# EAGLE design pro-one-mix-and-modified-noise (EAGLE 5.07)
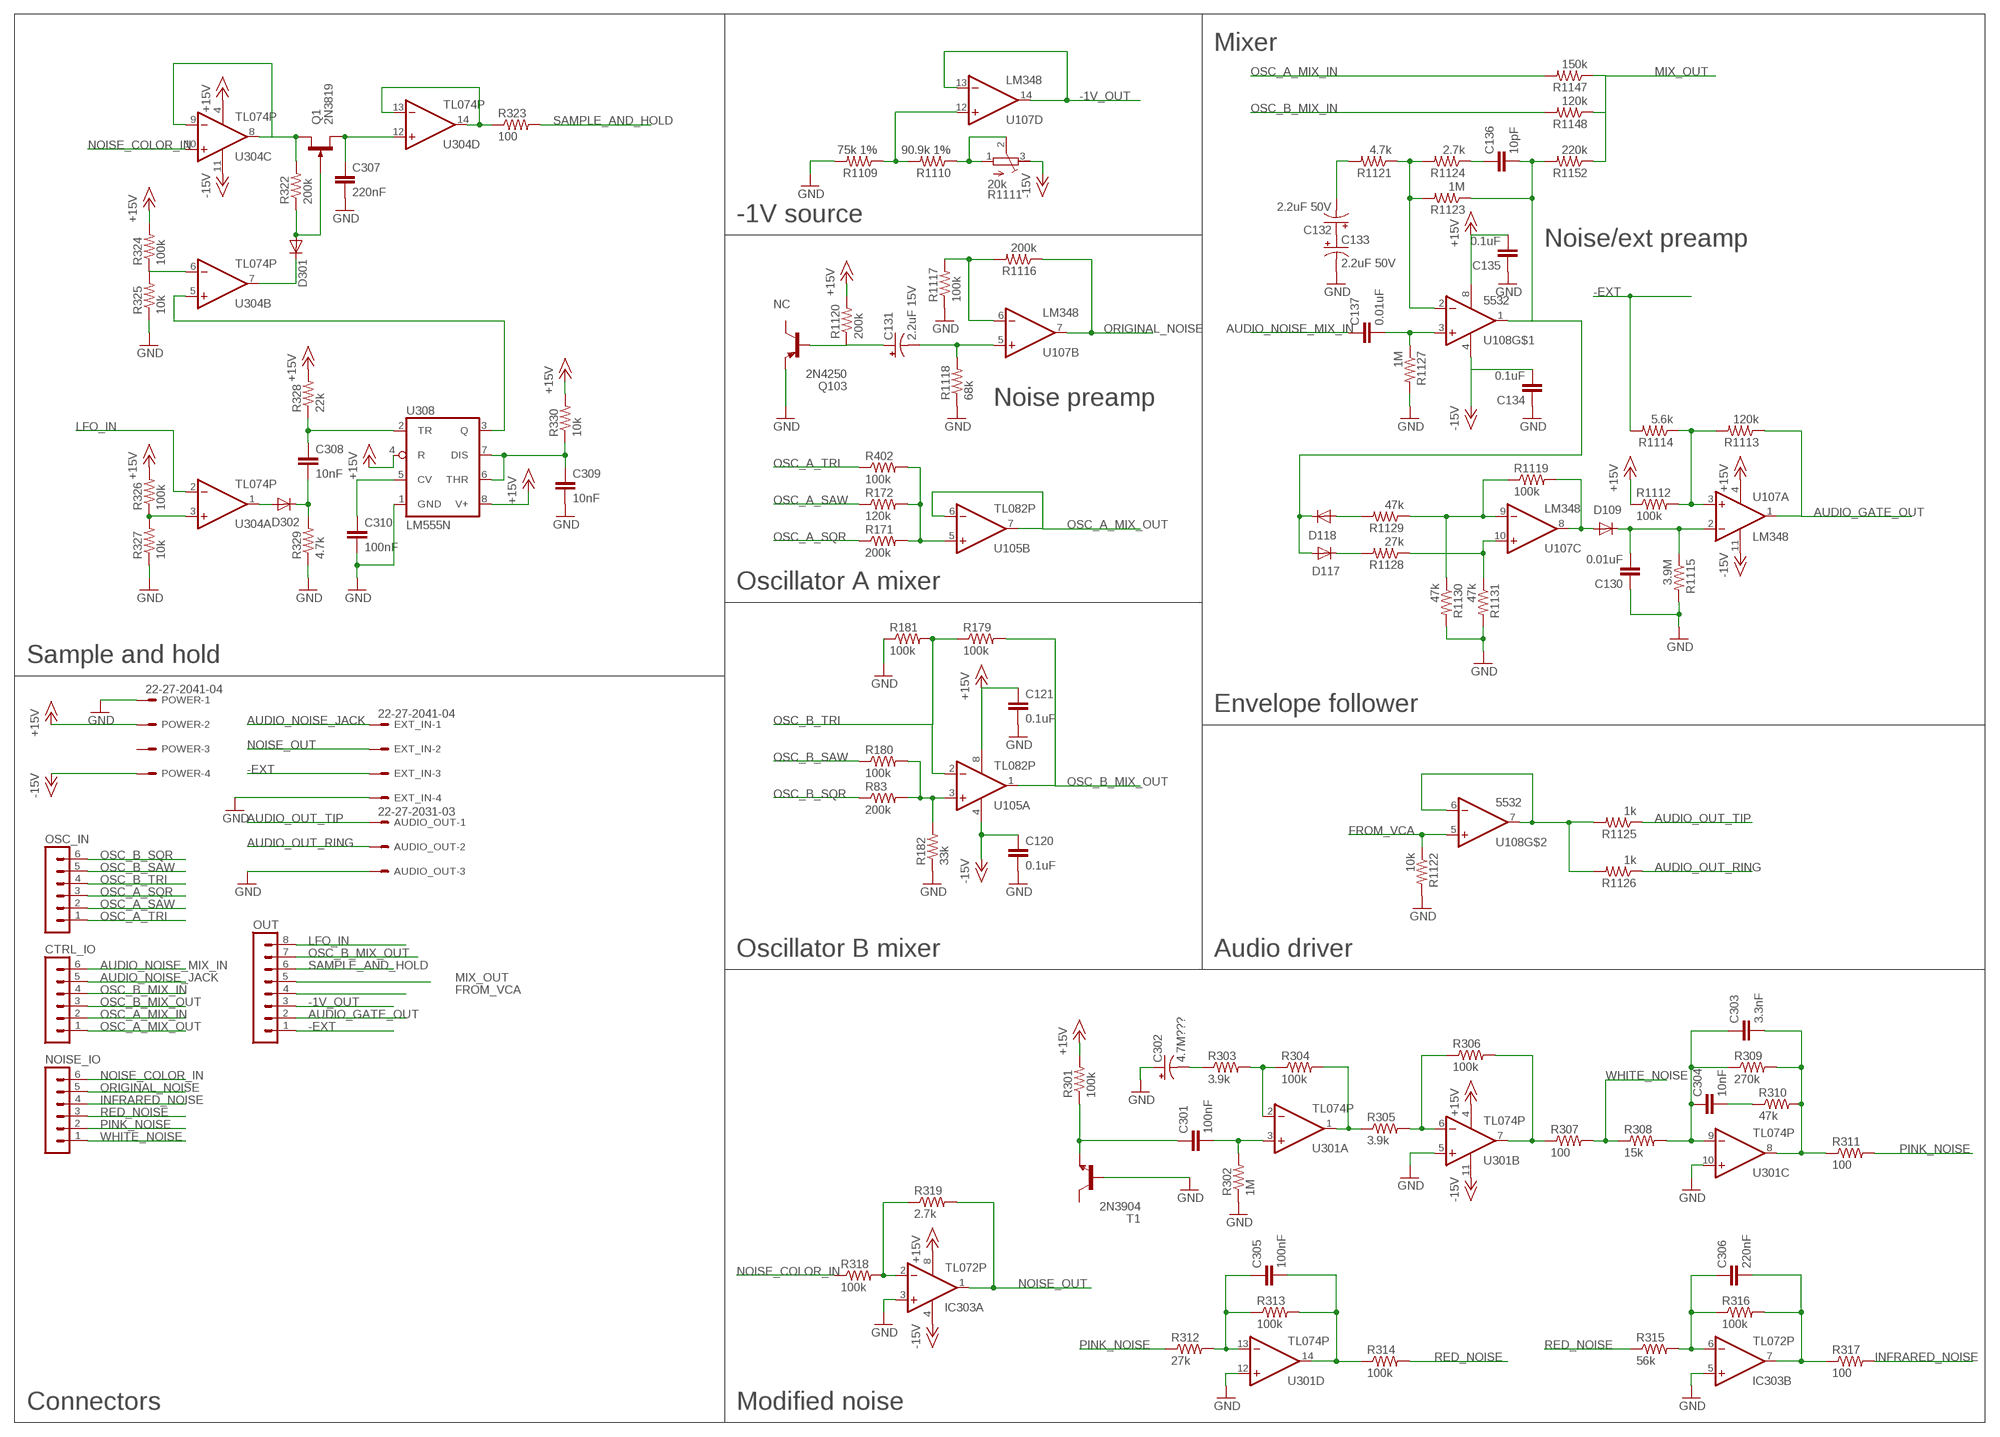
[diagram p0: schematic, sheet 1]

## Parts
AUDIO_OUT  22-27-2031-03  [6410-03]
C120  0.1uF  C-EU050-025X075  [C050-025X075]
C121  0.1uF  C-EU050-025X075  [C050-025X075]
C130  0.01uF  C-EU050-025X075  [C050-025X075]
C131  2.2uF 15V  CPOL-USE2.5-5  [E2,5-5]
C132  2.2uF 50V  CPOL-USE2.5-5  [E2,5-5]
C133  2.2uF 50V  CPOL-USE2.5-5  [E2,5-5]
C134  0.1uF  C-EU050-025X075  [C050-025X075]
C135  0.1uF  C-EU050-025X075  [C050-025X075]
C136  10pF  C-EU050-025X075  [C050-025X075]
C137  0.01uF  C-EU050-025X075  [C050-025X075]
C301  100nF  C-EU050-025X075  [C050-025X075]
C302  4.7M???  CPOL-USE2.5-5  [E2,5-5]
C303  3.3nF  C-EU050-025X075  [C050-025X075]
C304  10nF  C-EU050-025X075  [C050-025X075]
C305  100nF  C-EU050-025X075  [C050-025X075]
C306  220nF  C-EU050-025X075  [C050-025X075]
C307  220nF  C-EU050-025X075  [C050-025X075]
C308  10nF  C-EU050-025X075  [C050-025X075]
C309  10nF  C-EU050-025X075  [C050-025X075]
C310  100nF  C-EU050-025X075  [C050-025X075]
CTRL_IO  MA06-1  [MA06-1]
D109  1N4148DO35-7  [DO35-7]
D117  1N4148DO35-7  [DO35-7]
D118  1N4148DO35-7  [DO35-7]
D301  1N4148DO35-7  [DO35-7]
D302  1N4148DO35-7  [DO35-7]
EXT_IN  22-27-2041-04  [6410-04]
IC303  TL072P  [DIL08]
NOISE_IO  MA06-1  [MA06-1]
OSC_IN  MA06-1  [MA06-1]
OUT  MA08-1  [MA08-1]
POWER  22-27-2041-04  [6410-04]
Q1  2N3819  [TO92F]
Q103  2N4250  [TO92]
R83  200k  R-US_0309/10  [0309/10]
R171  200k  R-US_0309/10  [0309/10]
R172  120k  R-US_0309/10  [0309/10]
R179  100k  R-US_0309/10  [0309/10]
R180  100k  R-US_0309/10  [0309/10]
R181  100k  R-US_0309/10  [0309/10]
R182  33k  R-US_0309/10  [0309/10]
R301  100k  R-US_0309/10  [0309/10]
R302  1M  R-US_0309/10  [0309/10]
R303  3.9k  R-US_0309/10  [0309/10]
R304  100k  R-US_0309/10  [0309/10]
R305  3.9k  R-US_0309/10  [0309/10]
R306  100k  R-US_0309/10  [0309/10]
R307  100  R-US_0309/10  [0309/10]
R308  15k  R-US_0309/10  [0309/10]
R309  270k  R-US_0309/10  [0309/10]
R310  47k  R-US_0309/10  [0309/10]
R311  100  R-US_0309/10  [0309/10]
R312  27k  R-US_0309/10  [0309/10]
R313  100k  R-US_0309/10  [0309/10]
R314  100k  R-US_0309/10  [0309/10]
R315  56k  R-US_0309/10  [0309/10]
R316  100k  R-US_0309/10  [0309/10]
R317  100  R-US_0309/10  [0309/10]
R318  100k  R-US_0309/10  [0309/10]
R319  2.7k  R-US_0309/10  [0309/10]
R322  200k  R-US_0309/10  [0309/10]
R323  100  R-US_0309/10  [0309/10]
R324  100k  R-US_0309/10  [0309/10]
R325  10k  R-US_0309/10  [0309/10]
R326  100k  R-US_0309/10  [0309/10]
R327  10k  R-US_0309/10  [0309/10]
R328  22k  R-US_0309/10  [0309/10]
R329  4.7k  R-US_0309/10  [0309/10]
R330  10k  R-US_0309/10  [0309/10]
R402  100k  R-US_0309/10  [0309/10]
R1109  75k 1%  R-US_0309/10  [0309/10]
R1110  90.9k 1%  R-US_0309/10  [0309/10]
R1111  20k  R-TRIMM64W  [RTRIM64W]
R1112  100k  R-US_0309/10  [0309/10]
R1113  120k  R-US_0309/10  [0309/10]
R1114  5.6k  R-US_0309/10  [0309/10]
R1115  3.9M  R-US_0309/10  [0309/10]
R1116  200k  R-US_0309/10  [0309/10]
R1117  100k  R-US_0309/10  [0309/10]
R1118  68k  R-US_0309/10  [0309/10]
R1119  100k  R-US_0309/10  [0309/10]
R1120  200k  R-US_0309/10  [0309/10]
R1121  4.7k  R-US_0309/10  [0309/10]
R1122  10k  R-US_0309/10  [0309/10]
R1123  1M  R-US_0309/10  [0309/10]
R1124  2.7k  R-US_0309/10  [0309/10]
R1125  1k  R-US_0309/10  [0309/10]
R1126  1k  R-US_0309/10  [0309/10]
R1127  1M  R-US_0309/10  [0309/10]
R1128  27k  R-US_0309/10  [0309/10]
R1129  47k  R-US_0309/10  [0309/10]
R1130  47k  R-US_0309/10  [0309/10]
R1131  47k  R-US_0309/10  [0309/10]
R1147  150k  R-US_0309/10  [0309/10]
R1148  120k  R-US_0309/10  [0309/10]
R1152  220k  R-US_0309/10  [0309/10]
T1  2N3904  [TO92]
U105  TL082P  [DIL08]
U107  LM348  [DIL14]
U108  5532  [DIL08]
U301  TL074P  [DIL14]
U304  TL074P  [DIL14]
U308  LM555N  [DIL08]

## Nets
+15V: C121.1 C135.2 IC303.8(P:V+) POWER.2 R301.2 R324.2 R326.2 R328.2 R330.2 R1112.1 R1120.2 U105.8(P:V+) U107.4(P:V+) U108.8(V+) U301.4(P:V+) U304.4(P:V+) U308.4(R) U308.8(V+)
-1V_OUT: OUT.3 U107.13(D:-IN) U107.14(D:OUT)
-15V: C120.1 C134.2 IC303.4(P:V-) POWER.4 R1111.3(A) U105.4(P:V-) U107.11(P:V-) U108.4(V-) U301.11(P:V-) U304.11(P:V-)
-EXT: EXT_IN.3 OUT.1 R1114.2
AUDIO_GATE_OUT: OUT.2 R1113.1 U107.1(A:OUT)
AUDIO_NOISE_JACK: CTRL_IO.5 EXT_IN.1
AUDIO_NOISE_MIX_IN: C137.1 CTRL_IO.6
AUDIO_OUT_RING: AUDIO_OUT.2 R1126.1
AUDIO_OUT_TIP: AUDIO_OUT.1 R1125.1
FROM_VCA: OUT.4 R1122.1 U108.5(+IN)
GND: C120.2 C121.2 C130.1 C133.- C134.1 C135.1 C302.+ C307.2 C309.2 C310.2 EXT_IN.4 IC303.3(A:+IN) IC303.5(B:+IN) POWER.1 Q103.3(E) R181.1 R182.1 R302.1 R325.1 R327.1 R329.1 R1109.2 R1115.2 R1117.1 R1118.1 R1122.2 R1127.2 R1130.2 R1131.2 T1.2(B) U301.5(B:+IN) U301.10(C:+IN) U301.12(D:+IN) U308.1(GND)
INFRARED_NOISE: NOISE_IO.4 R317.2
LFO_IN: OUT.8 U304.2(A:-IN)
MIX_OUT: OUT.5 R1147.1 R1148.1 R1152.1
N$1: R171.2 R172.2 R402.2 U105.5(B:+IN)
N$2: R83.2 R180.2 R182.2 U105.3(A:+IN)
N$3: C131.- R1118.2 U107.5(B:+IN)
N$4: C131.+ Q103.2(B) R1120.1
N$5: R1116.2 R1117.2 U107.6(B:-IN)
N$6: C132.+ C133.+
N$7: R1109.1 R1110.2 U107.12(D:+IN)
N$8: R1110.1 R1111.1(E) R1111.2(S)
N$9: C132.- R1121.2
N$10: D118.A R1129.2
N$11: C136.1 R1124.1
N$12: C136.2 D117.A D118.C R1123.1 R1152.2 U108.1(OUT)
N$13: C137.2 R1127.1 U108.3(+IN)
N$14: R1121.1 R1123.2 R1124.2 U108.2(-IN)
N$15: D117.C R1128.2
N$16: R1119.1 R1129.1 R1130.1 U107.9(C:-IN)
N$17: R1128.1 R1131.1 U107.10(C:+IN)
N$18: R1112.2 R1113.2 R1114.1 U107.3(A:+IN)
N$19: R1125.2 R1126.2 U108.6(-IN) U108.7(OUT)
N$20: C301.1 R301.1 T1.3(E)
N$21: D109.A R1119.2 U107.8(C:OUT)
N$22: C130.2 D109.C R1115.1 U107.2(A:-IN)
N$23: C301.2 R302.2 U301.3(A:+IN)
N$24: C302.- R303.1
N$25: R303.2 R304.1 U301.2(A:-IN)
N$26: R304.2 R305.1 U301.1(A:OUT)
N$27: R305.2 R306.1 U301.6(B:-IN)
N$28: C305.1 R312.2 R313.1 U301.13(D:-IN)
N$29: R306.2 R307.1 U301.7(B:OUT)
N$30: C305.2 R313.2 R314.1 U301.14(D:OUT)
N$31: C303.1 C304.1 R308.2 R309.1 U301.9(C:-IN)
N$32: C306.1 IC303.6(B:-IN) R315.2 R316.1
N$33: C304.2 R310.1
N$34: C303.2 R309.2 R310.2 R311.1 U301.8(C:OUT)
N$35: C306.2 IC303.7(B:OUT) R316.2 R317.1
N$36: R324.1 R325.2 U304.6(B:-IN)
N$37: IC303.2(A:-IN) R318.2 R319.1
N$38: R326.1 R327.2 U304.3(A:+IN)
N$39: D302.A U304.1(A:OUT)
N$40: C308.2 D302.C R329.2
N$41: C308.1 R328.1 U308.2(TR)
N$42: U304.5(B:+IN) U308.3(Q)
N$43: C310.1 U308.5(CV)
N$44: C309.1 R330.1 U308.6(THR) U308.7(DIS)
N$45: D301.C U304.7(B:OUT)
N$46: D301.A Q1.G R322.1
N$47: Q1.D R322.2 U304.8(C:OUT) U304.9(C:-IN)
N$48: C307.1 Q1.S U304.12(D:+IN)
N$49: R323.1 U304.13(D:-IN) U304.14(D:OUT)
N$50: AUDIO_OUT.3 ; supply symbol labelled GND
NOISE_COLOR_IN: NOISE_IO.6 R318.1 U304.10(C:+IN)
NOISE_OUT: EXT_IN.2 IC303.1(A:OUT) R319.2
ORIGINAL_NOISE: NOISE_IO.5 R1116.1 U107.7(B:OUT)
OSC_A_MIX_IN: CTRL_IO.2 R1147.2
OSC_A_MIX_OUT: CTRL_IO.1 U105.6(B:-IN) U105.7(B:OUT)
OSC_A_SAW: OSC_IN.2 R172.1
OSC_A_SQR: OSC_IN.3 R171.1
OSC_A_TRI: OSC_IN.1 R402.1
OSC_B_MIX_IN: CTRL_IO.4 R1148.2
OSC_B_MIX_OUT: CTRL_IO.3 OUT.7 R179.2 U105.1(A:OUT)
OSC_B_SAW: OSC_IN.5 R180.1
OSC_B_SQR: OSC_IN.6 R83.1
OSC_B_TRI: OSC_IN.4 R179.1 R181.2 U105.2(A:-IN)
PINK_NOISE: NOISE_IO.2 R311.2 R312.1
RED_NOISE: NOISE_IO.3 R314.2 R315.1
SAMPLE_AND_HOLD: OUT.6 R323.2
WHITE_NOISE: NOISE_IO.1 R307.2 R308.1
Unconnected: POWER.3 Q103.1(C) T1.1(C)

## Notes on the sheet
- Mixer
- -1V source
- Noise/ext preamp
- NC
- Noise preamp
- Oscillator A mixer
- Sample and hold
- Envelope follower
- Oscillator B mixer | Audio driver
- Connectors | Modified noise

## Library data of the parts
AUDIO_OUT = con-molex:22-?-03: CONNECTOR wire to board 2.54 mm (.1 inch) pitch header
C120 C121 C130 C134-C137 C301 C303-C310 = resistor:C-EU: CAPACITOR, European symbol
C131-C133 C302 = rcl:CPOL-US: POLARIZED CAPACITOR, American symbol
CTRL_IO NOISE_IO OSC_IN = con-lstb:MA06-1: PIN HEADER
D109 D117 D118 D301 D302 = diode:1N4148: DIODE high speed (Philips)
EXT_IN POWER = con-molex:22-?-04: CONNECTOR wire to board 2.54 mm (.1 inch) pitch header
IC303 = linear:TL072: OP AMP
OUT = con-lstb:MA08-1: PIN HEADER
Q1 = transistor-small-signal:2N3819: N-CHANNEL FET
Q103 = joakim:2N4250: PNP Transistor
R83 R171 R172 R179-R182 R301-R319 R322-R330 R402 R1109 R1110 R1112-R1131 R1147 R1148 R1152 = resistor:R-US_: RESISTOR, American symbol
R1111 = resistor:R-TRIMM: Trimm resistor
T1 = transistor:2N3904: NPN TRANSISTOR
U105 = linear:TL082: OP AMP
U107 = joakim:LM348: Quad General Purpose, Low Voltage, Operational Amplifiers
U108 = joakim:5532: DUAL LOW-NOISE OPERATIONAL AMPLIFIERS
U301 U304 = linear:TL074: OP AMP
U308 = linear:*555: TIMER

## Board
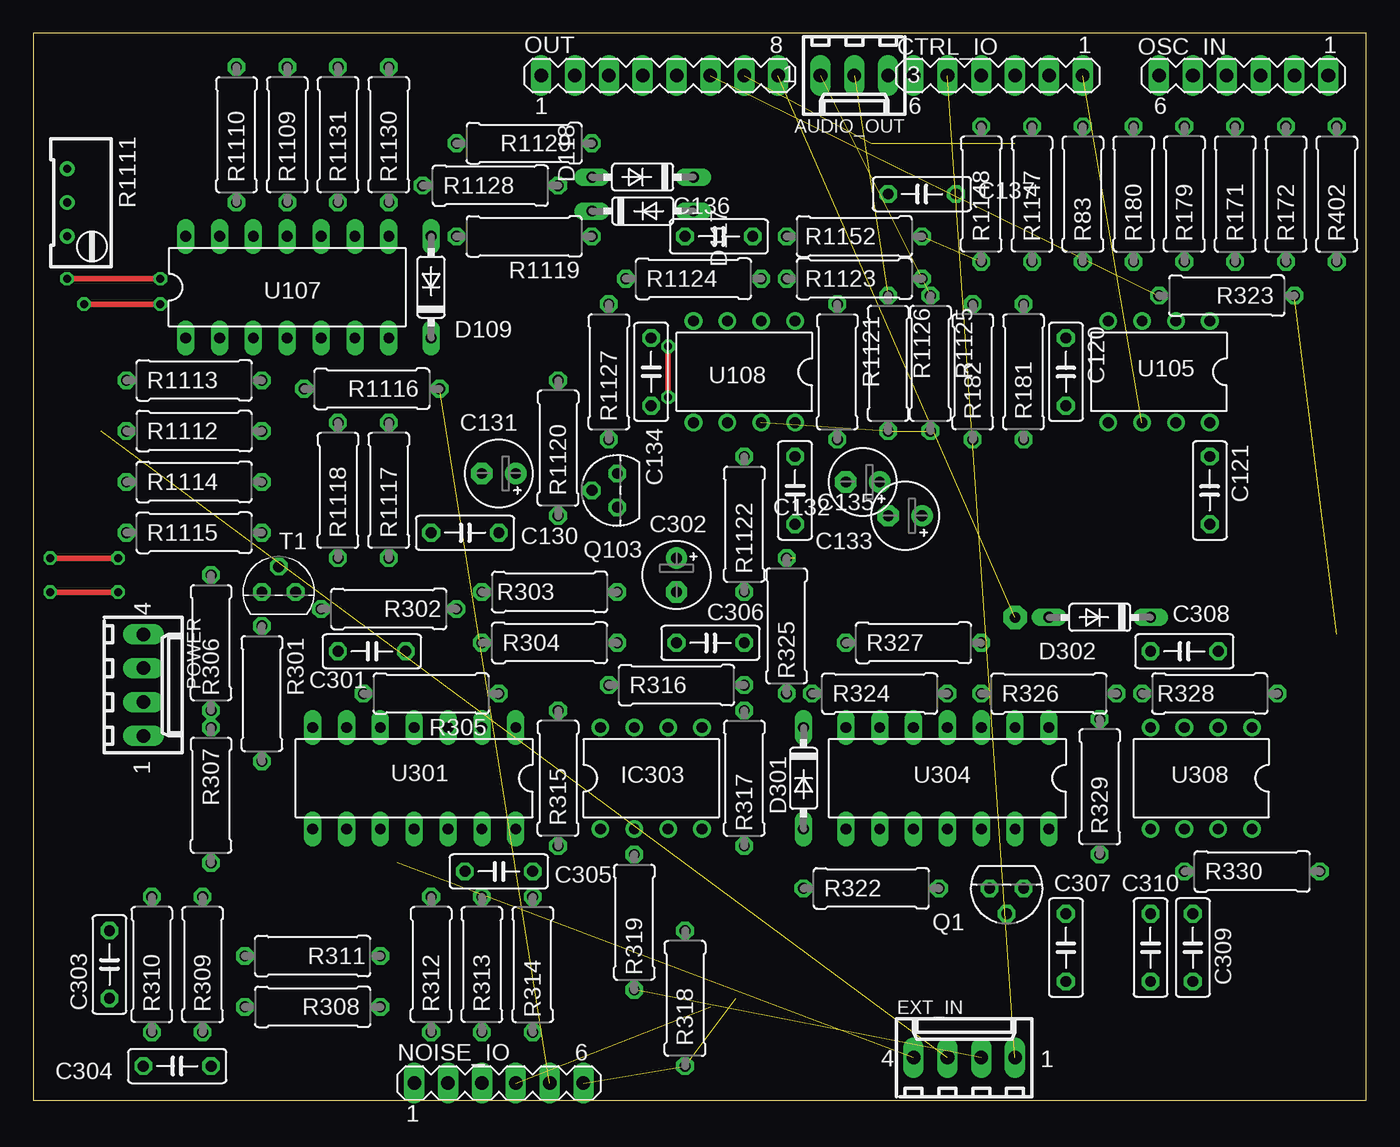
[diagram p1: board, top side]
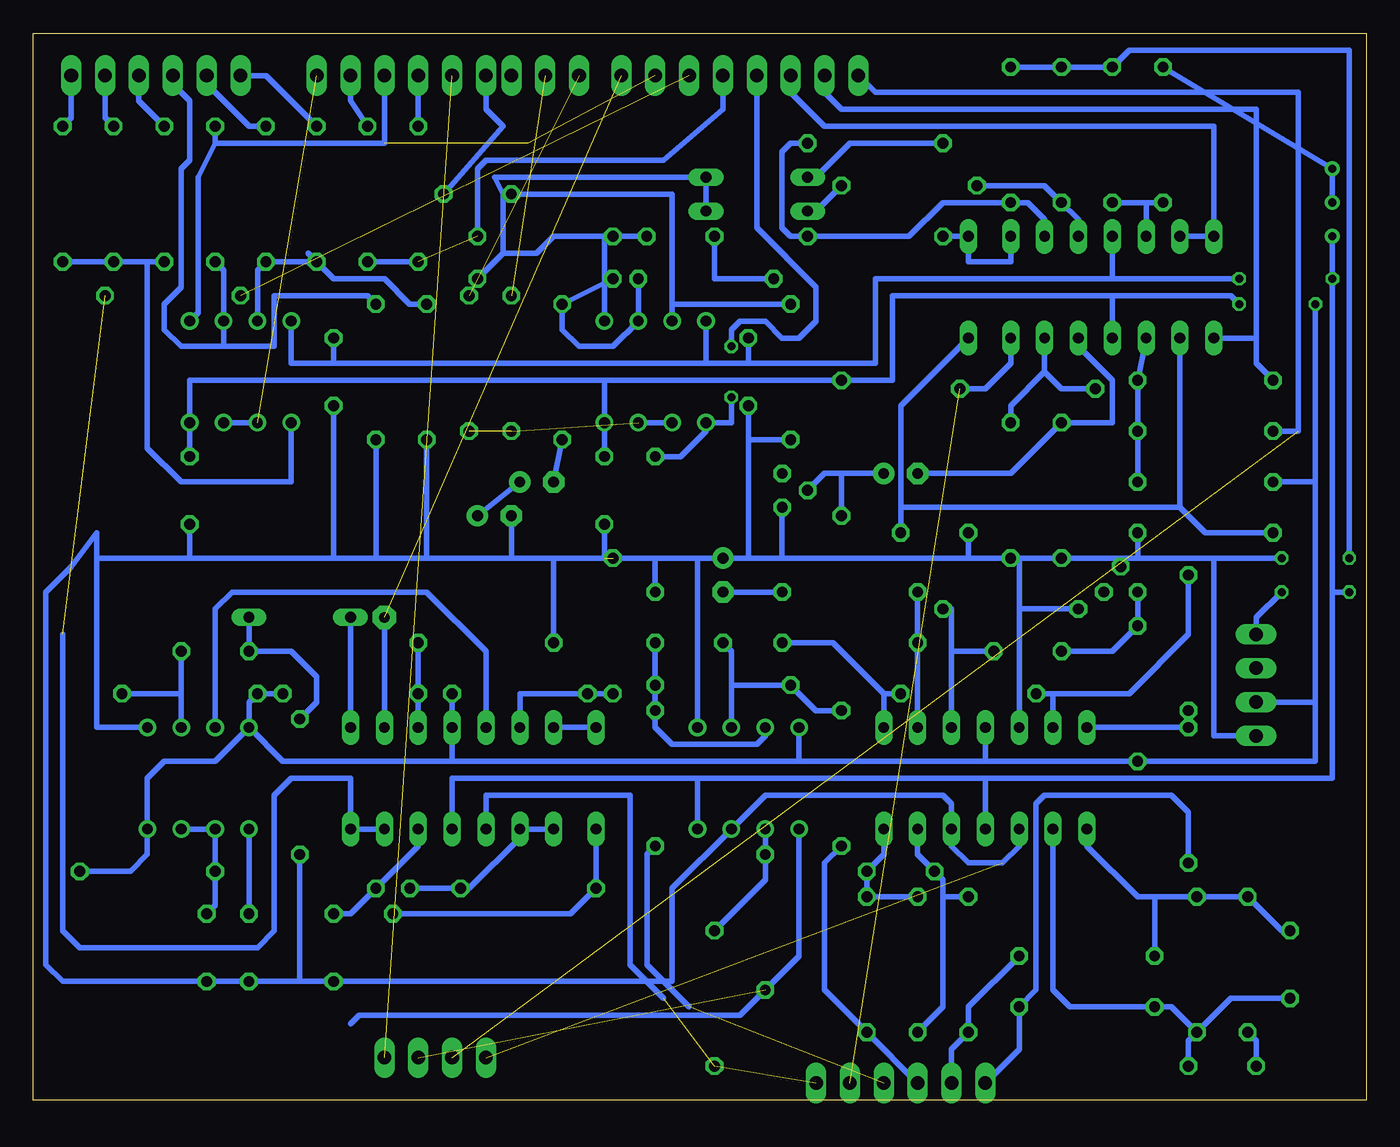
[diagram p2: board, bottom side, seen from below]

Size 100 x 80 mm. Coordinates in mm from the lower left corner, seen from the top.
Outline: 0,0 100,0 100,80 0,80 0,0
Copper layers (1*16): Top 0.035mm / dielectric 1.5mm / Bottom 0.035mm
Design rules "default": minimum track width 10mil, minimum drill 24mil, track to track 8mil, track to pad 8mil, pad to pad 8mil, via to via 8mil, smd to smd 8mil, copper to edge 40mil, drill to drill 8mil, minimum pad ring 10mil, minimum via ring 8mil, stop-mask expansion 4mil, vias tented up to drill 0mil, thermal gap 10mil

### Footprints (pad centres in the part's own frame; a part is rotated, then mirrored left to right if it is on the bottom)
6410-03 = drill 1.016 long: 1 2.54,0; 2 0,0; 3 -2.54,0
C050-025X075 = drill 0.813 octagon: 1 -2.54,0; 2 2.54,0
E2,5-5 = drill 0.813 pad 1.6 round: + -1.27,0 | drill 0.813 pad 1.6 octagon: - 1.27,0
MA06-1 = drill 1.016 long: 1 -6.35,0; 2 -3.81,0; 3 -1.27,0; 4 1.27,0; 5 3.81,0; 6 6.35,0
DO35-7 = drill 0.813 long: A 3.81,0; C -3.81,0
6410-04 = drill 1.016 long: 1 3.81,0; 2 1.27,0; 3 -1.27,0; 4 -3.81,0
DIL08 = drill 0.813 pad 1.27 round: 1 -3.81,-3.81; 2 -1.27,-3.81; 3 1.27,-3.81; 4 3.81,-3.81; 5 3.81,3.81; 6 1.27,3.81; 7 -1.27,3.81; 8 -3.81,3.81
MA08-1 = drill 1.016 long: 1 -8.89,0; 2 -6.35,0; 3 -3.81,0; 4 -1.27,0; 5 1.27,0; 6 3.81,0; 7 6.35,0; 8 8.89,0
TO92F = drill 0.813 octagon: D 1.27,0; G 0,1.905; S -1.27,0
TO92 = drill 0.813 octagon: 1 1.27,0; 2 0,1.905; 3 -1.27,0
0309/10 = drill 0.813 octagon: 1 -5.08,0; 2 5.08,0
RTRIM64W = drill 0.61 round: 1 1.27,-2.54; 2 1.27,0; 3 1.27,2.54
DIL14 = drill 0.813 long: 1 -7.62,-3.81; 2 -5.08,-3.81; 3 -2.54,-3.81; 4 0,-3.81; 5 2.54,-3.81; 6 5.08,-3.81; 7 7.62,-3.81; 8 7.62,3.81; 9 5.08,3.81; 10 2.54,3.81; 11 0,3.81; 12 -2.54,3.81; 13 -5.08,3.81; 14 -7.62,3.81

### Placement (x,y rotation side)
AUDIO_OUT  61.59,76.83 180 top
C120  77.47,54.61 270 top
C121  88.27,45.72 270 top
C130  32.38,42.55 0 top
C131  34.92,46.99 180 top
C132  62.23,46.35 180 top
C133  65.41,43.81 180 top
C134  46.35,54.61 90 top
C135  57.15,45.72 90 top
C136  51.44,64.77 0 top
C137  66.67,67.94 180 top
C301  25.4,33.66 0 top
C302  48.26,39.37 270 top
C303  5.71,10.16 90 top
C304  10.79,2.54 180 top
C305  34.92,17.14 0 top
C306  50.8,34.29 0 top
C307  77.47,11.43 270 top
C308  86.36,33.66 180 top
C309  87,11.43 270 top
C310  83.82,11.43 270 top
CTRL_IO  72.39,76.83 180 top
D109  29.84,60.96 90 top
D117  45.72,66.67 0 top
D118  45.72,69.22 180 top
D301  57.78,24.13 270 top
D302  80.01,36.2 180 top
EXT_IN  69.85,3.17 0 top
IC303  46.35,24.13 0 top
NOISE_IO  34.92,1.27 0 top
OSC_IN  90.81,76.83 180 top
OUT  46.99,76.83 0 top
POWER  8.26,31.11 270 top
Q1  73.03,15.88 180 top
Q103  43.81,45.72 90 top
R83  78.74,67.94 270 top
R171  90.17,67.94 270 top
R172  93.98,67.94 270 top
R179  86.36,67.94 90 top
R180  82.55,67.94 270 top
R181  74.3,54.61 90 top
R182  70.48,54.61 90 top
R301  17.14,30.48 270 top
R302  26.67,36.83 0 top
R303  38.73,38.1 180 top
R304  38.73,34.29 0 top
R305  29.84,30.48 180 top
R306  13.34,34.29 270 top
R307  13.34,22.86 270 top
R308  20.95,6.99 180 top
R309  12.7,10.16 90 top
R310  8.89,10.16 90 top
R311  20.95,10.79 0 top
R312  29.84,10.16 90 top
R313  33.66,10.16 90 top
R314  37.47,10.16 270 top
R315  39.37,24.13 90 top
R316  48.26,31.11 0 top
R317  53.34,24.13 270 top
R318  48.9,7.62 90 top
R319  45.09,13.34 270 top
R322  62.87,15.88 0 top
R323  89.53,60.33 180 top
R324  63.5,30.48 0 top
R325  56.52,35.56 270 top
R326  76.2,30.48 0 top
R327  66.04,34.29 0 top
R328  88.27,30.48 180 top
R329  80.01,23.5 90 top
R330  91.44,17.14 0 top
R402  97.79,67.94 270 top
R1109  19.05,72.39 90 top
R1110  15.24,72.39 270 top
R1111  3.81,67.31 180 top
R1112  12.06,46.35 0 top
R1113  12.06,53.98 0 top
R1114  12.06,50.16 180 top
R1115  12.06,42.55 0 top
R1116  25.4,53.34 180 top
R1117  26.67,45.72 90 top
R1118  22.86,45.72 90 top
R1119  36.83,64.77 180 top
R1120  39.37,48.9 90 top
R1121  60.33,54.61 270 top
R1122  53.34,43.18 270 top
R1123  61.59,61.59 180 top
R1124  49.53,61.59 0 top
R1125  67.31,55.24 270 top
R1126  64.14,55.24 270 top
R1127  43.18,54.61 270 top
R1128  34.29,68.58 0 top
R1129  36.83,71.75 180 top
R1130  26.67,72.39 90 top
R1131  22.86,72.39 90 top
R1147  74.93,67.94 90 top
R1148  71.12,67.94 90 top
R1152  61.59,64.77 180 top
T1  18.41,38.1 0 top
U105  84.45,54.61 180 top
U107  19.05,60.96 0 top
U108  53.34,54.61 180 top
U301  28.57,24.13 180 top
U304  68.58,24.13 180 top
U308  87.63,24.13 180 top

### Tracks (layer width: path | path; a pad name or v marks a point on that pad's centre or on a via)
+15V  (via drill 0.6)
  Top 0.406: v3.81,59.69 v9.53,59.69
  Bottom 0.406: 19.05,60.33 35.56,60.33 35.56,53.98 R1120.2 57.15,53.98 | 57.15,53.98 88.27,53.98 U105.8 C121.1 | 19.05,60.33 U107.4 | U308.4 81.28,25.4 68.58,25.4 | 28.57,25.4 42.55,25.4 | 42.55,25.4 68.58,25.4 | 28.57,25.4 U301.4 | 68.58,25.4 U304.4 R324.2 | 3.81,46.35 v3.81,59.69 | 3.81,29.84 3.81,25.4 R301.2 28.57,25.4 | R330.2 92.71,17.14 91.44,18.41 U308.8 91.44,24.13 90.17,25.4 86.36,25.4 U308.4 | U308.4 83.82,29.84 R328.2 R326.2 | 42.55,25.4 IC303.8 | 3.81,46.35 R1112.1 | 57.15,53.98 U108.8 C135.2 | v9.53,59.69 10.16,60.33 19.05,60.33 | 3.81,29.84 POWER.2 | 3.81,29.84 3.81,46.35
-1V_OUT
  Bottom 0.406: U107.13 U107.14 11.43,73.03 40.64,73.03 43.18,75.56 OUT.3
-15V  (via drill 0.6)
  Top 0.406: v2.54,61.59 v9.53,61.59 | v1.27,38.1 v6.35,38.1
  Bottom 0.406: 19.05,61.59 U107.11 | U304.11 68.58,24.13 50.16,24.13 | 28.57,24.13 50.16,24.13 | 28.57,24.13 U301.11 | 50.16,24.13 IC303.4 | R1111.3 v2.54,61.59 2.54,38.1 | 19.05,61.59 36.83,61.59 36.83,55.24 46.35,55.24 | U105.4 80.64,55.24 77.47,55.24 | 49.53,55.24 U108.4 | 77.47,55.24 C120.1 | 49.53,55.24 77.47,55.24 | 46.35,55.24 C134.2 | 46.35,55.24 49.53,55.24 | v9.53,61.59 19.05,61.59 | 2.54,38.1 2.54,24.13 28.57,24.13 | POWER.4 8.26,36.2 v6.35,38.1 | 2.54,38.1 v1.27,38.1
-EXT  (1 unrouted)
  Bottom 0.406: R1114.2 5.08,50.16 5.08,75.56 36.83,75.56 OUT.1
AUDIO_GATE_OUT
  Bottom 0.406: 8.26,57.15 U107.1 | 8.26,57.15 8.26,74.3 39.37,74.3 40.64,75.56 OUT.2 | R1113.1 8.26,55.24 8.26,57.15
AUDIO_NOISE_JACK  (1 unrouted)
AUDIO_NOISE_MIX_IN
  Bottom 0.406: C137.1 64.77,73.03 66.04,74.3 CTRL_IO.6
AUDIO_OUT_RING  (1 unrouted)
AUDIO_OUT_TIP  (1 unrouted)
FROM_VCA  (via drill 0.6)
  Top 0.406: v47.62,52.7 v47.62,56.52
  Bottom 0.406: R1122.1 51.44,48.26 49.53,50.16 U108.5 47.62,50.8 v47.62,52.7 | v47.62,56.52 47.62,57.78 46.99,58.42 45.09,58.42 43.81,57.15 42.55,57.15 41.27,58.42 41.27,60.96 45.72,65.41 OUT.4
GND  (via drill 0.6)  (2 unrouted)
  Top 0.406: v6.35,40.64 v1.27,40.64
  Bottom 0.406: 80.01,8.89 C310.2 C309.2 97.79,8.89 99.06,10.16 99.06,38.1 97.16,40.01 95.25,42.55 95.25,40.64 | 80.01,8.89 R329.1 | POWER.1 11.43,27.3 11.43,40.64 | U308.1 95.25,27.94 95.25,40.64 | 80.01,8.89 C307.2 52.07,8.89 52.07,15.88 IC303.3 45.09,22.86 31.75,22.86 31.11,22.23 U301.12 31.11,19.05 29.84,17.78 27.3,17.78 26.04,19.05 U301.10 | 11.43,40.64 17.14,40.64 | 17.14,40.64 18.41,40.64 | 18.41,40.64 R1118.1 | R1118.1 26.04,40.64 | 50.16,40.64 C302.+ 46.35,40.64 | 50.16,40.64 IC303.5 | 26.04,40.64 26.04,36.83 | 26.04,36.83 U301.5 | 18.41,40.64 T1.2 | 26.04,36.83 R302.1 | 26.04,40.64 R1117.1 | R1117.1 29.84,40.64 | 29.84,40.64 43.81,40.64 | 43.81,40.64 46.35,40.64 | 50.16,40.64 53.34,40.64 | 53.34,40.64 57.15,40.64 | 57.15,40.64 60.96,40.64 | 64.14,40.64 70.48,40.64 | 70.48,40.64 74.3,40.64 | 74.3,40.64 77.47,40.64 | 77.47,40.64 88.27,40.64 | 88.27,40.64 95.25,40.64 | 60.96,40.64 R327.1 | 29.84,40.64 C130.1 | 43.81,40.64 Q103.3 | 17.14,40.64 R1115.2 | R1118.1 R1117.1 | R1130.2 R1131.2 R1109.2 17.78,78.74 1.27,78.74 v1.27,40.64 | 70.48,40.64 R182.1 | 74.3,40.64 R181.1 | 46.35,40.64 46.35,49.53 | 57.15,40.64 C135.1 | 46.35,49.53 C134.1 | 46.35,49.53 R1127.2 | 64.14,40.64 C133.- | 60.96,40.64 64.14,40.64 | 88.27,40.64 C121.2 | 77.47,40.64 C120.2 | 53.34,40.64 R1122.2 | 11.43,40.64 v6.35,40.64
INFRARED_NOISE  (1 unrouted)
  Bottom 0.406: R317.2 53.98,18.41 53.98,10.16 50.8,6.99
LFO_IN  (via drill 0.8 pad 1.78)  (1 unrouted)
  Bottom 0.406: U304.2 v73.66,36.2
MIX_OUT  (1 unrouted)
  Bottom 0.406: R1148.1 R1147.1 | OUT.5 48.26,74.3 52.7,70.48 66.04,70.48 66.67,69.85 R1152.1
N$1
  Bottom 0.406: R402.2 R172.2 91.44,62.87 | 91.44,62.87 R171.2 | U105.5 80.64,46.35 88.9,46.35 91.44,48.9 91.44,62.87
N$2
  Bottom 0.406: R83.2 R180.2 83.19,62.23 U105.3 | R83.2 77.47,61.59 73.66,61.59 71.75,59.69 R182.2 | R83.2 79.38,63.5
N$3
  Bottom 0.406: U107.5 21.59,56.52 19.05,53.98 19.05,50.8 R1118.2 26.67,46.99 C131.-
N$4
  Bottom 0.406: 39.37,46.99 C131.+ | 39.37,46.99 40.64,46.99 Q103.2 | R1120.1 39.37,46.99
N$5
  Bottom 0.406: 24.13,54.61 U107.6 | 24.13,54.61 22.86,53.34 R1116.2 | R1117.2 26.67,52.07 24.13,54.61
N$6
  Bottom 0.406: C133.+ C132.+
N$7
  Bottom 0.406: 16.51,67.31 R1110.2 | 16.51,67.31 R1109.1 | U107.12 16.51,67.31
N$8
  Bottom 0.406: R1110.1 R1111.1 R1111.2
N$9
  Bottom 0.406: R1121.2 C132.-
N$10
  Bottom 0.406: R1129.2 38.73,71.75 41.27,69.22 D118.A
N$11
  Bottom 0.406: R1124.1 48.9,61.59 C136.1
N$12
  Bottom 0.406: U108.1 57.15,64.77 R1152.2 | R1152.2 C136.2 | 64.77,63.5 62.23,63.5 60.96,64.77 R1152.2 | 64.77,63.5 R1123.1 | 64.77,63.5 64.77,67.94 65.41,69.22 D118.C D117.A
N$13
  Bottom 0.406: C137.2 52.07,67.94 52.07,59.69 | 52.07,59.69 U108.3 | R1127.1 52.07,59.69
N$14
  Bottom 0.406: R1124.2 U108.2 56.52,56.52 59.05,56.52 60.33,57.78 R1121.1 R1123.2
N$15
  Bottom 0.406: R1128.2 41.27,66.67 D117.C
N$16
  Bottom 0.406: U107.9 24.13,66.04 25.4,67.31 R1130.1 31.75,67.31 34.29,64.77 R1119.1 43.18,64.77 43.81,65.41 43.81,71.12 43.18,71.75 R1129.1
N$17
  Bottom 0.406: U107.10 21.59,66.04 R1131.1 24.13,68.58 R1128.1
N$18
  Bottom 0.406: U107.3 R1113.2 R1112.2 R1114.1
N$19  (2 unrouted)
  Bottom 0.406: U108.6 U108.7
N$20
  Bottom 0.406: C301.1 19.05,33.66 R301.1 T1.3
N$21
  Bottom 0.406: U107.8 26.67,62.87 29.84,62.87 D109.A R1119.2
N$22
  Bottom 0.406: D109.C 34.92,52.07 34.92,44.45 | R1115.1 12.06,42.55 13.97,44.45 | 13.97,44.45 34.92,44.45 | 34.92,44.45 C130.2 | 13.97,44.45 U107.2
N$23
  Bottom 0.406: U301.3 31.11,33.66 | 31.11,33.66 31.11,36.83 R302.2 | 31.11,33.66 C301.2
N$24
  Bottom 0.406: R303.1 C302.-
N$25
  Bottom 0.406: U301.2 R304.1 R303.2
N$26
  Bottom 0.406: 36.2,30.48 U301.1 | R305.1 36.2,30.48 | 36.2,30.48 40.01,34.29 R304.2
N$27
  Bottom 0.406: 23.5,30.48 U301.6 | 23.5,30.48 17.78,30.48 13.34,34.92 R306.1 | 23.5,30.48 R305.2
N$28
  Bottom 0.406: U301.13 33.66,18.41 C305.1 31.75,16.51 31.75,15.24 | 31.75,15.24 31.75,6.99 R313.1 | 31.75,15.24 R312.2
N$29
  Bottom 0.406: U301.7 R307.1 R306.2
N$30
  Bottom 0.406: U301.14 36.2,18.41 C305.2 R314.1 R313.2
N$31
  Bottom 0.406: C304.1 13.34,4.45 R309.1 | C303.1 10.16,7.62 R309.1 | R309.1 14.61,6.99 R308.2 22.23,6.99 23.5,8.26 U301.9
N$32
  Bottom 0.406: 47.62,31.11 IC303.6 | 47.62,31.11 47.62,33.66 C306.1 | 47.62,31.11 R316.1 41.27,29.21 R315.2
N$33
  Bottom 0.406: C304.2 8.26,4.45 R310.1
N$34
  Bottom 0.406: C303.2 6.35,12.7 R310.2 R309.2 15.88,15.24 | 15.88,15.24 R311.1 | 15.88,15.24 17.14,15.24 20.95,19.05 U301.8
N$35
  Bottom 0.406: C306.2 R316.2 R317.1 53.34,27.94 52.07,26.67 45.72,26.67 45.09,27.3 IC303.7
N$36
  Bottom 0.406: R325.2 R324.1 63.5,30.48 U304.6
N$37
  Bottom 0.406: IC303.2 R319.1 45.09,16.51 R318.2
N$38
  Bottom 0.406: U304.3 R326.1 R327.2
N$39
  Bottom 0.406: U304.1 D302.A
N$40
  Bottom 0.406: R329.2 78.74,29.84 78.74,31.75 80.64,33.66 C308.2 D302.C
N$41
  Bottom 0.406: U308.2 88.9,30.48 | 88.9,30.48 R328.1 | 88.9,30.48 C308.1
N$42
  Bottom 0.406: U308.3 86.36,36.83 85.09,38.1 70.48,38.1 66.04,33.66 U304.5
N$43
  Bottom 0.406: C310.1 U308.5
N$44
  Bottom 0.406: U308.7 U308.6 R330.1 86.36,14.61 C309.1
N$45
  Bottom 0.406: D301.C U304.7
N$46
  Bottom 0.406: D301.A R322.1 59.69,13.97 Q1.G
N$47
  Bottom 0.406: U304.8 U304.9 63.5,19.68 67.31,15.88 R322.2 Q1.D
N$48
  Bottom 0.406: U304.12 71.12,19.05 Q1.S 76.2,13.97 C307.1
N$49  (1 unrouted)
  Bottom 0.406: U304.13 U304.14 76.2,24.13 80.64,24.13 81.92,22.86 81.92,12.7 83.19,11.43 96.52,11.43 97.79,12.7 97.79,34.92
NOISE_COLOR_IN  (2 unrouted)
  Bottom 0.406: U304.10 66.04,22.86 55.24,22.86 55.24,10.16 52.7,7.62
NOISE_OUT  (1 unrouted)
  Bottom 0.406: IC303.1 42.55,10.79 R319.2 46.99,6.35 75.56,6.35 76.2,5.71
ORIGINAL_NOISE  (1 unrouted)
  Bottom 0.406: U107.7 26.67,55.24 28.57,53.34 R1116.1
OSC_A_MIX_IN
  Bottom 0.406: R1147.2 76.2,74.93 CTRL_IO.2
OSC_A_MIX_OUT  (1 unrouted)
  Bottom 0.406: U105.6 U105.7
OSC_A_SAW
  Bottom 0.406: R172.1 94.61,73.66 OSC_IN.2
OSC_A_SQR
  Bottom 0.406: R171.1 92.08,74.93 OSC_IN.3
OSC_A_TRI
  Bottom 0.406: R402.1 97.16,73.66 OSC_IN.1
OSC_B_MIX_IN
  Bottom 0.406: R1148.2 CTRL_IO.4
OSC_B_MIX_OUT  (2 unrouted)
  Bottom 0.406: 86.36,71.75 73.66,71.75 CTRL_IO.3 | U105.1 87.63,59.05 87.63,69.22 86.36,71.75 | 86.36,71.75 R179.2
OSC_B_SAW
  Bottom 0.406: OSC_IN.5 87,76.2 83.82,73.03 R180.1
OSC_B_SQR
  Bottom 0.406: R83.1 82.55,76.83 OSC_IN.6
OSC_B_TRI
  Bottom 0.406: R179.1 85.72,62.23 U105.2 85.72,56.52 | R181.2 74.93,60.33 81.92,60.33 81.92,56.52 85.72,56.52 | OSC_IN.4 89.53,76.2 88.27,74.93 88.27,70.48 88.9,69.85 88.9,60.96 90.17,59.69 90.17,57.78 88.9,56.52 85.72,56.52
PINK_NOISE
  Bottom 0.406: NOISE_IO.2 31.11,3.81 R312.1 29.84,6.99 R311.2
RED_NOISE
  Bottom 0.406: R315.1 40.64,17.78 40.64,8.26 R314.2 NOISE_IO.3
SAMPLE_AND_HOLD  (1 unrouted)
WHITE_NOISE
  Bottom 0.406: NOISE_IO.1 26.04,3.81 R308.1 24.77,8.26 24.77,22.23 24.13,22.86 14.61,22.86 13.34,21.59 R307.2